# Altium schematic sheet Test1.SchDoc
size A3; SheetNumber: 1; SheetTotal: 2
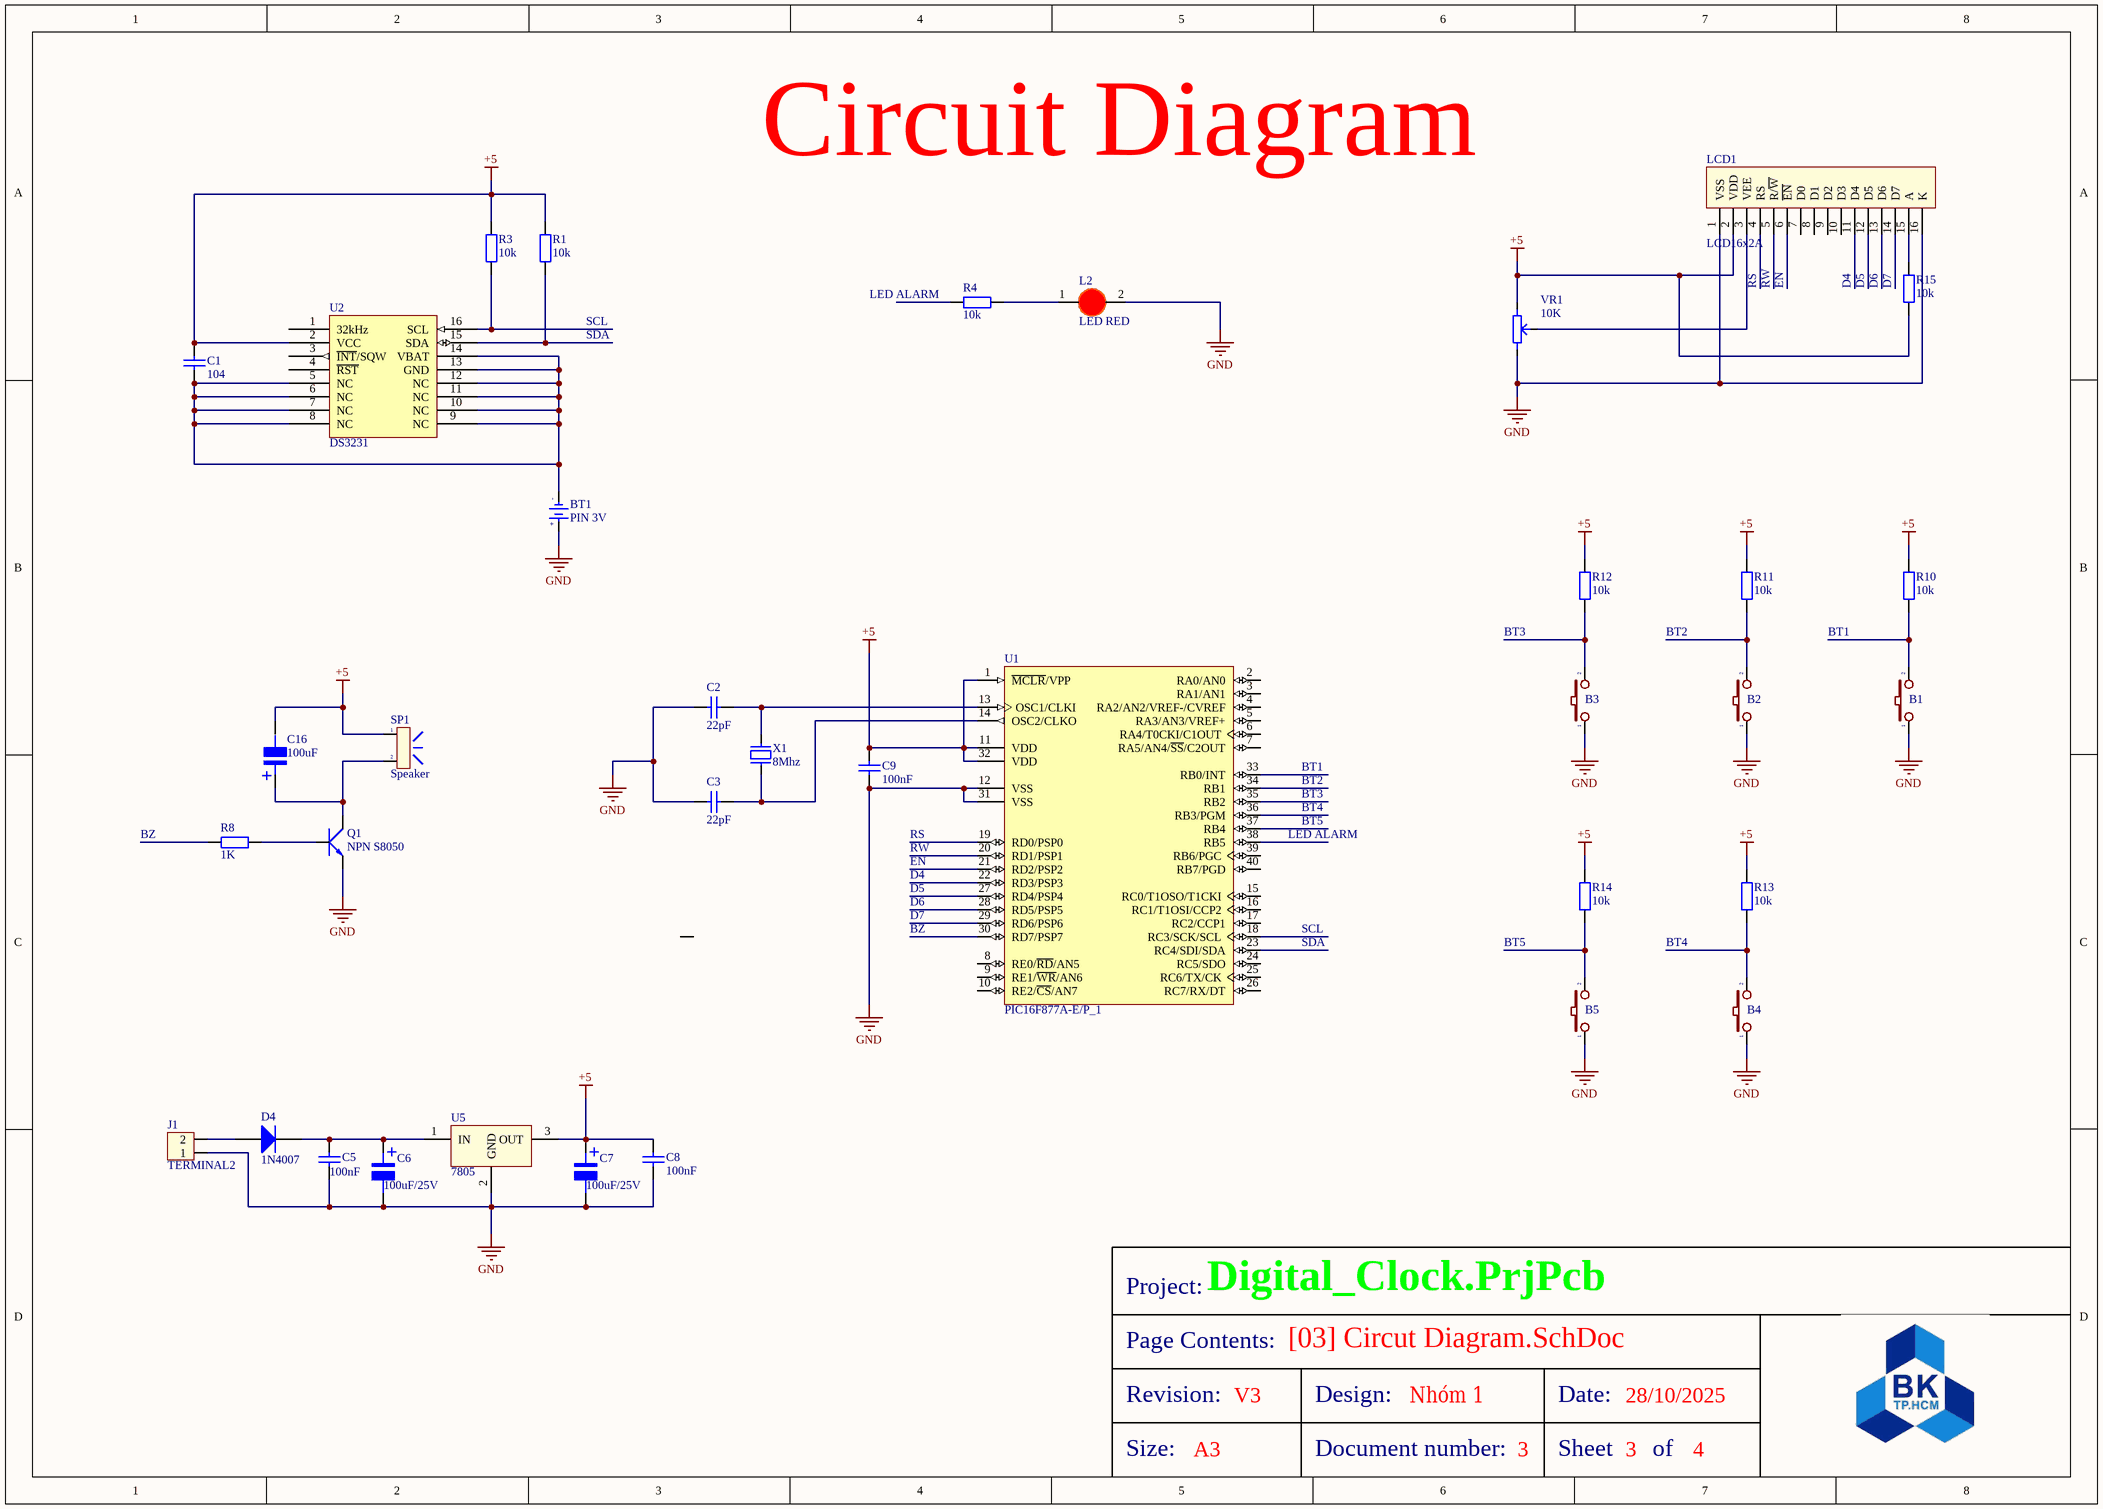
[diagram p0: Test1.SchDoc]

## Parts
B1  (no value)  [SW2]
B2  (no value)  [SW2]
B3  (no value)  [SW2]
B4  (no value)  [SW2]
B5  (no value)  [SW2]
BT1  PIN 3V  [PIN3V]
C1  104  [tu gom]
C2  22pF  [tu gom]
C3  22pF  [tu gom]
C5  100nF  [tu gom]
C6  100uF/25V  [tu nhom 10 (g)]
C7  100uF/25V  [tu nhom 10 (g)]
C8  100nF  [tu gom]
C9  100nF  [tu gom]
C16  100uF  [tu nhom 10 (g)]
D4  1N4007  [DIODE SOD-123]
J1  TERMINAL2  [Header 2P DC 2.54]
L2  LED RED  [LED-5MM-RED]
LCD1  LCD16x2A  [LCD16X2]
Q1  NPN S8050  [QTO-92]
R1  10k  [tro smd 0603]
R3  10k  [tro smd 0603]
R4  10k  [tro smd 0603]
R8  1K  [tro smd 0603]
R10  10k  [tro smd 0603]
R11  10k  [tro smd 0603]
R12  10k  [tro smd 0603]
R13  10k  [tro smd 0603]
R14  10k  [tro smd 0603]
R15  10k  [tro smd 0603]
SP1  Speaker  [SPK]
U1  PIC16F877A-E/P_1  [PDIP600-P40]
U2  DS3231  [SL3016]
U5  7805  [QTO-220]
VR1  10K  [Bien Tro Tam Giac Dung]
X1  8Mhz  [XT2]

## Nets
+5: C1.1 C7.1 C8.1 C9.1 C16.2 LCD1.2(VDD) R1.2 R3.2 R10.1 R11.1 R12.1 R13.1 R14.1 R15.1 SP1.1 U1.1(~{MCLR}/VPP) U1.11(VDD) U1.32(VDD) U2.2(VCC) U5.3(OUT) VR1.1
GND: B1.1 B2.1 B3.1 B4.1 B5.1 BT1.1(+3V) C2.2 C3.2 C5.2 C6.2 C7.2 C8.2 C9.2 J1.1 L2.2(K) LCD1.1(VSS) LCD1.16(K) Q1.1(E) U1.12(VSS) U1.31(VSS) U5.2(GND) VR1.3
NetB1_2: B1.2 R10.2
NetB2_2: B2.2 R11.2
NetB3_2: B3.2 R12.2
NetB4_2: B4.2 R13.2
NetB5_2: B5.2 R14.2
NetBT1_2: BT1.2(GND) C1.2 U2.5(NC) U2.6(NC) U2.7(NC) U2.8(NC) U2.9(NC) U2.10(NC) U2.11(NC) U2.12(NC) U2.13(GND) U2.14(VBAT)
NetC2_1: C2.1 U1.13(OSC1/CLKI) X1.1
NetC3_1: C3.1 U1.14(OSC2/CLKO) X1.2
NetC5_1: C5.1 C6.1 D4.2(K) U5.1(IN)
NetC16_1: C16.1 Q1.2(C) SP1.2
NetD4_1: D4.1(A) J1.2
NetL2_1: L2.1(A) R4.2
NetLCD1_3: LCD1.3(VEE) VR1.2
NetLCD1_15: LCD1.15(A) R15.2
NetQ1_3: Q1.3(B) R8.2
NetR1_1: R1.1 U2.15(SDA)
NetR3_1: R3.1 U2.16(SCL)

Not connected (* = marked no-connect by the designer): LCD1 4(RS) 5(R/~{W}) 6(~{EN}) 7(D0) 8(D1) 9(D2) 10(D3) 11(D4) 12(D5) 13(D6) 14(D7); R4 1; R8 1; U1 2(RA0/AN0) 3(RA1/AN1) 4(RA2/AN2/VREF-/CVREF) 5(RA3/AN3/VREF+) 6(RA4/T0CKI/C1OUT) 7(RA5/AN4/~{SS}/C2OUT) 8(RE0/~{RD}/AN5) 9(RE1/~{WR}/AN6) 10(RE2/~{CS}/AN7) 15(RC0/T1OSO/T1CKI) 16(RC1/T1OSI/CCP2) 17(RC2/CCP1) 18(RC3/SCK/SCL) 19(RD0/PSP0) 20(RD1/PSP1) 21(RD2/PSP2) 22(RD3/PSP3) 23(RC4/SDI/SDA) 24(RC5/SDO) 25(RC6/TX/CK) 26(RC7/RX/DT) 27(RD4/PSP4) 28(RD5/PSP5) 29(RD6/PSP6) 30(RD7/PSP7) 33(RB0/INT) 34(RB1) 35(RB2) 36(RB3/PGM) 37(RB4) 38(RB5) 39(RB6/PGC) 40(RB7/PGD); U2 1(32kHz) 3(~{INT}/SQW) 4(~{RST})

## Notes on the sheet
- Circuit Diagram
- (near R4) LED ALARM
- RS
- RW
- EN
- D4
- (near R15) D5
- (near R15) D6
- (near R15) D7
- SCL
- SDA
- BT3
- BT2
- BT1
- BZ
- LED ALARM
- BT4
- BT5
- D5
- D6
- D7
- [03] Circut Diagram.SchDoc
- A3
- V3
- Nhóm 1
- 3
- 28/10/2025
- 4
- Project:
- Digital_Clock.PrjPcb
- Page Contents:
- Revision:
- Size:
- Design:
- Document number:
- Date:
- Sheet
- of
- (in symbol PIN 3V) -; +
- (in symbol Tu Nhom 100uF 35V) +

## Library data of the parts
B1-B5 = SW2: Switch button 2 pin; Value: SW chip 2 pin
BT1 = PIN 3V: Battery 3VDC; Value: PIN 3V
C1 = Tu gom 104 50V: Cắm; So_Chan: 2; Ten_Linh_Kien: Tụ gốm 104 100nF 50V; Don_Vi: Con; Ma_Hang: MH004761; Chung_Loai: Cắm; Kieu_Chan: *
C2 C3 C5 C8 C9 = Tu gom 22pF 50V: Cắm; Don_Vi: Con; So_Chan: 2; Ten_Linh_Kien: Tụ gốm 22P 50V; Ma_Hang: MH004771; Chung_Loai: Cắm; Kieu_Chan: *
C6 C7 C16 = Tu Nhom 100uF 35V: Dán; Don_Vi: Con; Ten_Linh_Kien: Tụ Nhôm 100uF 35V; Ma_Hang: MH004019; So_Chan: 2; Chung_Loai: Dán; Kieu_Chan: *
D4 = Diode S4: Dán; Ten_Linh_Kien: Diode S4 SOD123 ( 1N5819 SOD123); Ma_Hang: MH005519; Don_Vi: Con; Ghi_Chu: *; Chung_Loai: Dán; Kieu_Chan: *
J1 = Header 2P 2.54 Duc Cong: Cắm; Ten_Linh_Kien: Header 2P XH2.54-2P Đực Cong; Don_Vi: Con; Ma_Hang: MH002852; Chung_Loai: Cắm
L2 = LED 5mm Do: Cắm; Don_Vi: Con; Ma_Hang: MH008967; Ten_Linh_Kien: Led 5MM Phủ Đỏ (1000c); Ghi_Chu: *; Kieu_Chan: *; Chung_Loai: Cắm
LCD1 = LCD16x2: LCD dipslay 16 char, 2 line; Value: LCD16x2A
Q1 = NPN_ECB: P 600mW, ECB; Value: C1815
R1 R3 R4 R8 R10-R15 = Tro 0603 5% 10k: Dán; Don_Vi: Con; So_Chan: 2; Ten_Linh_Kien: Trở 0603 5% 10k; Ma_Hang: MH006316; Chung_Loai: Dán; Kieu_Chan: *
SP1 = SPK: Speaker Chip; Value: Speaker Chip
U1 = PIC16F877A-E/P_1: Enhanced FLASH Microcontroller, 8K (x14-Bit words) FLASH, 368 Bytes RAM, 40-Pin PDIP, Standard VDD Range, Extended Temperature; ComponentAvailability: Unknown. Contact manufacturer to determine status.; Published: 11-Oct-2004; LatestRevisionDate: 29-Jan-2009; LatestRevisionNote: Sch. layout revised. 3D Model Removed.; DatasheetVersion: revB, Oct-2003; PackageVersion: revBB, Aug-2009; PackageReference: PDIP600-P40; Publisher: Altium Limited; PackageDescription: 40-Lead Plastic Dual In-Line (P) - 600 mil Body [PDIP]; Supplier 1: Digi-Key; Supplier Part Number 1: PIC16F877A-E/P-ND; Supplier 2: Farnell; Supplier Part Number 2: 1567990; ComponentLink1Description: Datasheet; ComponentLink1URL: http://ww1.microchip.com/downloads/en/DeviceDoc/39582b.pdf; ComponentLink2Description: Packaging Specification; ComponentLink2URL: http://www.microchip.com/stellent/groups/techpub_sg/documents/packagingspec/en012702.pdf; ComponentLink3Description: Microchip.com Home; ComponentLink3URL: http://www.microchip.com/
U5 = LM78xx: On ap +, from + 5 to + 24VDC; Value: LM7805
VR1 = Bien tro tam giac 10K Dung: Cắm; Ma_Hang: MH000919; Don_Vi: Con; Ten_Linh_Kien: Biến Trở Tam Giác 103-10K RM065 (Chân Đứng); Chung_Loai: Cắm; Kieu_Chan: *
X1 = XT2: Crystal For all Crystal 2pin.; Value: 8Mhz